# EAGLE design multiline_sensor (EAGLE 9.6.0)
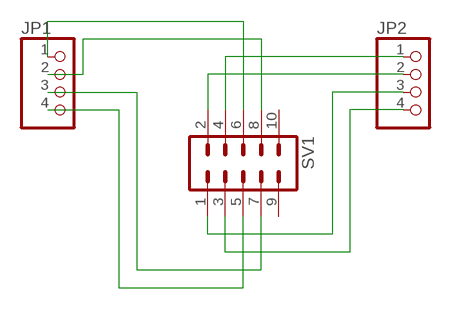
[diagram p0: schematic, sheet 1]

## Parts
JP1  PINHD-1X4  [1X04]
JP2  PINHD-1X4  [1X04]
SV1  ML10  [ML10]

## Nets
N$1: JP2.4 SV1.3
N$2: JP2.3 SV1.1
N$3: JP2.2 SV1.2
N$4: JP2.1 SV1.4
N$5: JP1.1 SV1.6
N$6: JP1.2 SV1.8
N$7: JP1.3 SV1.7
N$8: JP1.4 SV1.5
Unconnected: SV1.9 SV1.10

## Library data of the parts
JP1 JP2 = pinhead:PINHD-1X4: PIN HEADER
SV1 = con-harting-ml:ML10: HARTING; OC_FARNELL: unknown; OC_NEWARK: unknown

## Board
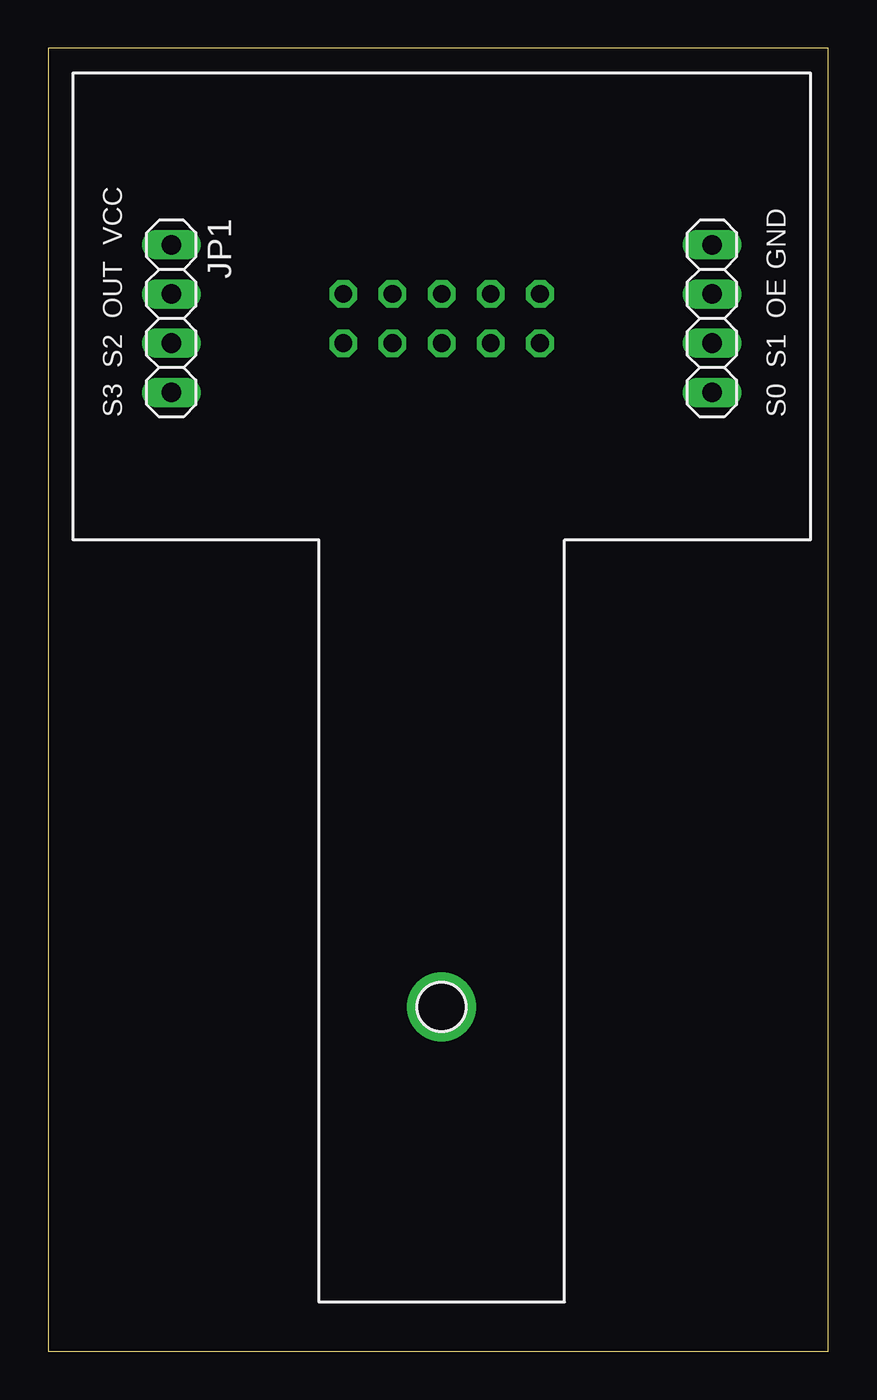
[diagram p1: board, top side]
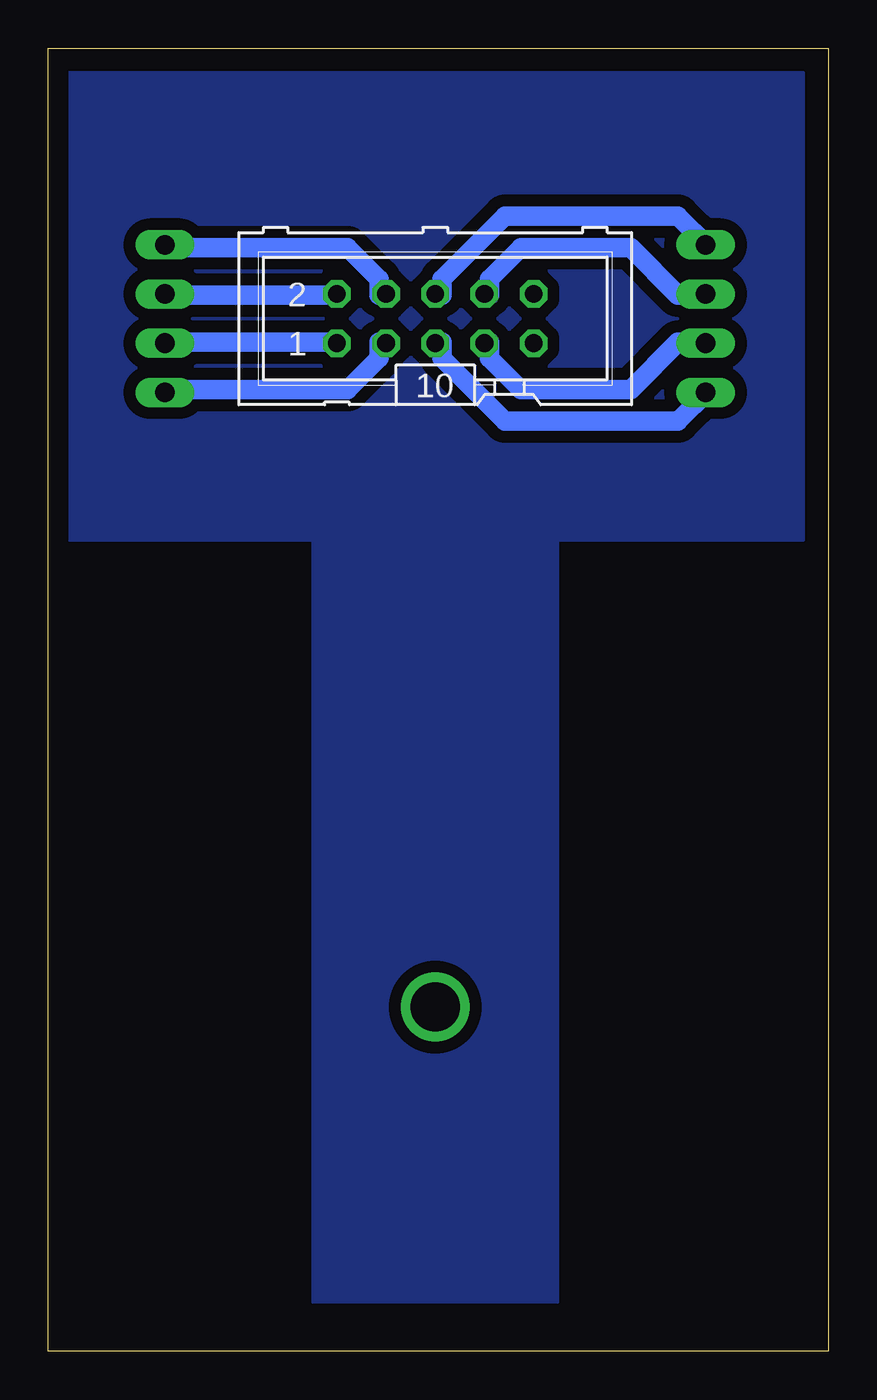
[diagram p2: board, bottom side, seen from below]

Size 40.31 x 67.3 mm. Coordinates in mm from the lower left corner, seen from the top.
Outline: 0,0 40.31,0 40.31,67.3 0,67.3 0,0
Copper layers (1*16): Top 0.035mm / dielectric 1.5mm / Bottom 0.035mm
Design rules "default *": minimum track width 40mil, minimum drill 0.35mm, track to track 24mil, track to pad 24mil, pad to pad 24mil, via to via 24mil, smd to smd 6mil, copper to edge 40mil, drill to drill 6mil, minimum pad ring 10mil, minimum via ring 8mil, stop-mask expansion 4mil, vias tented up to drill 0mil, thermal gap 10mil

### Footprints (pad centres in the part's own frame; a part is rotated, then mirrored left to right if it is on the bottom)
1X04 = drill 1.016 long: 1 -3.81,0; 2 -1.27,0; 3 1.27,0; 4 3.81,0
ML10 = drill 0.914 octagon: 1 -5.08,-1.27; 2 -5.08,1.27; 3 -2.54,-1.27; 4 -2.54,1.27; 5 0,-1.27; 6 0,1.27; 7 2.54,-1.27; 8 2.54,1.27; 9 5.08,-1.27; 10 5.08,1.27

### Placement (x,y rotation side)
JP1  6.35,53.34 270 top
JP2  34.29,53.34 270 top
SV1  20.32,53.34 0 bottom

### Tracks (layer width: path | path; a pad name or v marks a point on that pad's centre or on a via)
GND
  pour Bottom: 1.27,66.04 39.37,66.04 39.37,41.91 26.67,41.91 26.67,2.54 13.97,2.54 13.97,41.91 1.27,41.91
N$1
  Bottom 1.016: SV1.3 23.22,52.12 23.22,51.31 24.84,49.68 33.78,49.68 JP2.4
N$2
  Bottom 1.016: SV1.1 25.65,52.12 33.78,52.12 JP2.3
N$3
  Bottom 1.016: SV1.2 25.65,54.56 33.78,54.56 JP2.2
N$4
  Bottom 1.016: SV1.4 23.22,54.56 23.22,55.37 24.84,57 33.78,57 JP2.1
N$5
  Bottom 1.016: SV1.6 19.96,54.56 19.96,55.37 16.71,58.62 7.77,58.62 6.96,57.81 JP1.1
N$6
  Bottom 1.016: SV1.8 17.53,54.56 17.53,55.37 15.9,57 10.21,57 7.77,54.56 6.96,54.56 JP1.2
N$7
  Bottom 1.016: SV1.7 17.53,52.12 17.53,51.31 15.9,49.68 10.21,49.68 7.77,52.12 6.96,52.12 JP1.3
N$8
  Bottom 1.016: SV1.5 19.96,52.12 19.96,51.31 16.71,48.06 7.77,48.06 6.96,48.87 JP1.4
N$9  (via drill 2.54 pad 2.54)
  other vias: 20.32,17.78

### Text on the board
tPlace: VCC | GND | OUT | OE | S2 | S1 | S3 | S0